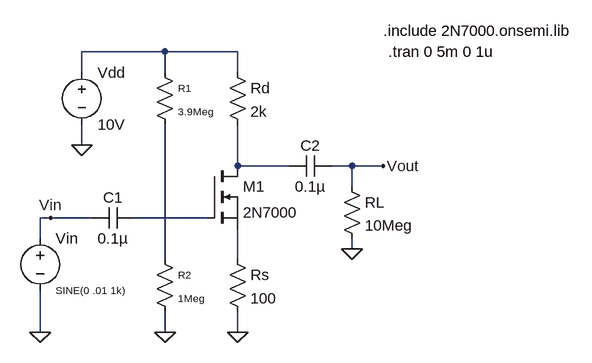
[diagram p0: schematic cs amp with source degeneration v001.asc]
cs amp with source degeneration v001.asc, the LTspice schematic file:
Version 4.1
SHEET 1 1600 1036
WIRE 48 16 -80 16
WIRE 160 16 48 16
WIRE -80 48 -80 16
WIRE 48 48 48 16
WIRE 160 48 160 16
WIRE -80 160 -80 128
WIRE 160 192 160 128
WIRE 240 192 160 192
WIRE 336 192 304 192
WIRE 384 192 336 192
WIRE 336 224 336 192
WIRE -128 272 -144 272
WIRE -64 272 -128 272
WIRE 112 272 0 272
WIRE -144 304 -144 272
WIRE 336 320 336 304
WIRE 48 336 48 128
WIRE 160 336 160 288
WIRE -144 448 -144 384
WIRE 48 448 48 416
WIRE 160 448 160 416
FLAG 160 448 0
FLAG 48 448 0
FLAG -80 160 0
FLAG -144 448 0
FLAG 384 192 Vout
FLAG -128 272 Vin
FLAG 336 320 0
SYMBOL nmos 112 192 R0
SYMATTR InstName M1
SYMATTR Value 2N7000
SYMATTR Prefix X
SYMBOL res 144 320 R0
SYMATTR InstName Rs
SYMATTR Value 100
SYMBOL res 144 32 R0
SYMATTR InstName Rd
SYMATTR Value 2k
SYMBOL cap 0 256 R90
WINDOW 0 0 32 VBottom 2
WINDOW 3 32 32 VTop 2
SYMATTR InstName C1
SYMATTR Value 0.1µ
SYMBOL cap 304 176 R90
WINDOW 0 0 32 VBottom 2
WINDOW 3 32 32 VTop 2
SYMATTR InstName C2
SYMATTR Value 0.1µ
SYMBOL res 32 320 R0
WINDOW 0 36 40 Left 1
WINDOW 3 36 76 Left 1
SYMATTR InstName R2
SYMATTR Value 1Meg
SYMBOL res 32 32 R0
WINDOW 0 36 40 Left 1
WINDOW 3 36 76 Left 1
SYMATTR InstName R1
SYMATTR Value 3.9Meg
SYMBOL voltage -80 32 R0
SYMATTR InstName Vdd
SYMATTR Value 10V
SYMBOL voltage -144 288 R0
WINDOW 3 24 96 Left 1
WINDOW 123 24 124 Left 1
WINDOW 39 0 0 Left 0
SYMATTR InstName Vin
SYMATTR Value SINE(0 .01 1k)
SYMBOL res 320 208 R0
SYMATTR InstName RL
SYMATTR Value 10Meg
TEXT 384 -16 Left 2 !.include 2N7000.onsemi.lib
TEXT 392 16 Left 2 !.tran 0 5m 0 1u

The netlist it stands for:
* cs amp with source degeneration v001.asc
X§M1 N002 N003 N005 2N7000  ; pins D G S
Rs N005 0 100
Rd N001 N002 2k
C1 N003 Vin 0.1µ
C2 Vout N002 0.1µ
R2 N004 0 1Meg
R1 N001 N004 3.9Meg
Vdd N001 0 10V
Vin Vin 0 SINE(0 .01 1k)
RL Vout 0 10Meg
.include 2N7000.onsemi.lib
.tran 0 5m 0 1u
.backanno
.end